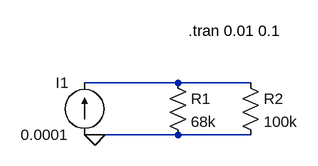
[diagram p0: schematic Draft30.asc]
Draft30.asc, the LTspice schematic file:
Version 4
SHEET 1 880 680
WIRE 336 256 192 256
WIRE 448 256 336 256
WIRE 208 336 192 336
WIRE 336 336 208 336
WIRE 448 336 336 336
FLAG 208 336 0
SYMBOL current 192 336 R180
WINDOW 0 24 80 Left 2
WINDOW 3 24 0 Left 2
SYMATTR InstName I1
SYMATTR Value 0.0001
SYMBOL res 320 240 R0
SYMATTR InstName R1
SYMATTR Value 68k
SYMBOL res 432 240 R0
SYMATTR InstName R2
SYMATTR Value 100k
TEXT 352 176 Left 2 !.tran 0.01 0.1

The netlist it stands for:
* Draft30.asc
I1 0 N001 0.0001
R1 N001 0 68k
R2 N001 0 100k
.tran 0.01 0.1
.backanno
.end